# Altium schematic sheet p.SchDoc
size A3
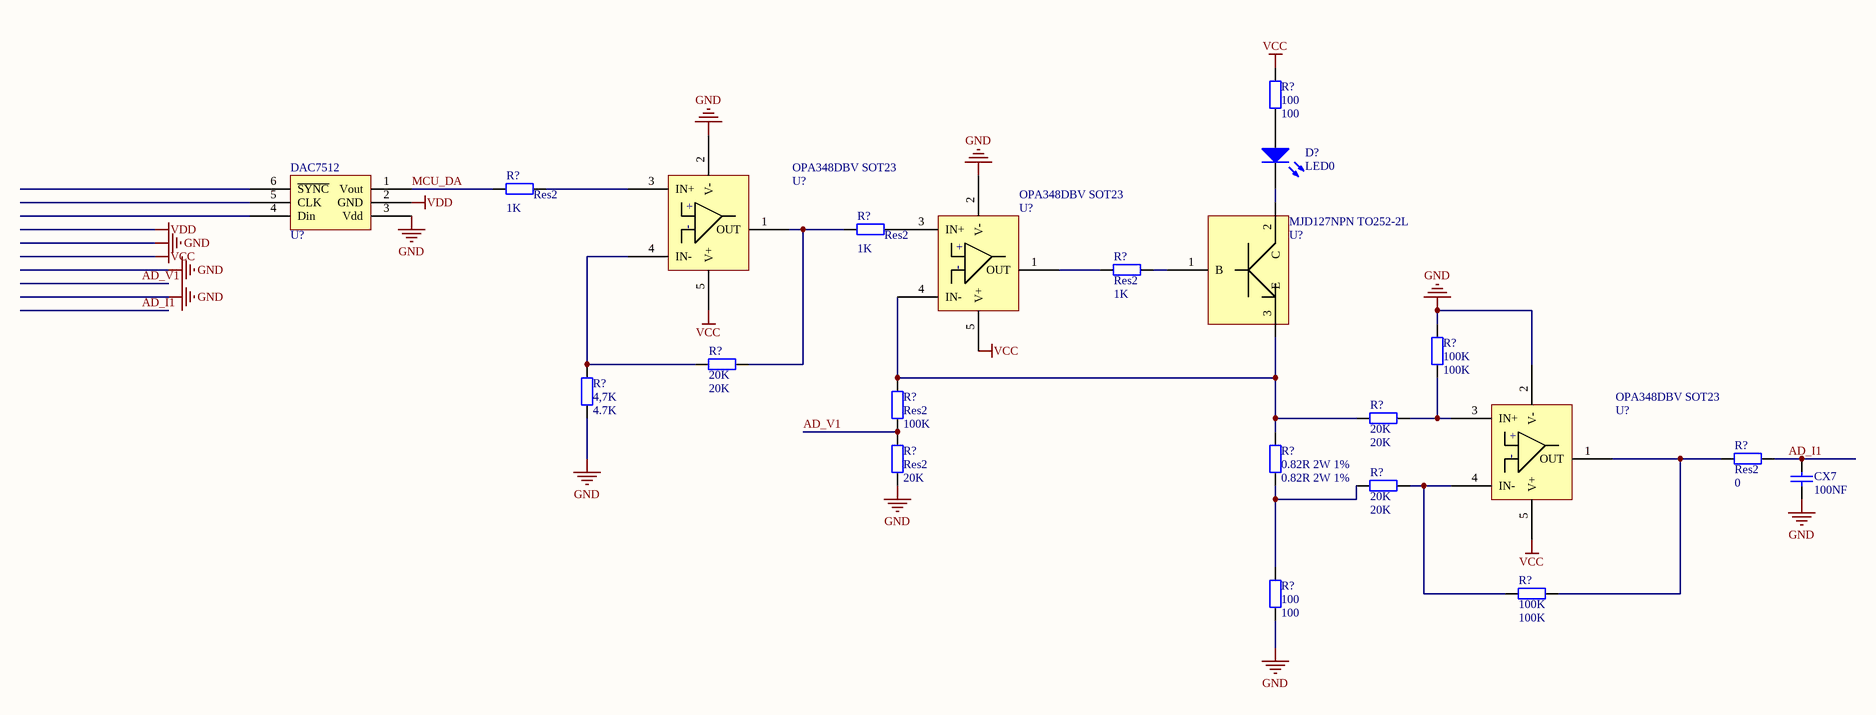
[diagram p0: p.SchDoc]

## Parts
(Parts that share a designator on the sheet are numbered #1, #2 ... from top to bottom, then left to right.)
CX7  100NF  [0603]
D?  LED0  [LED-0]
DAC7512  U?
MJD127NPN_TO252-2L  U?
OPA348DBV_SOT23#1  U?
OPA348DBV_SOT23#2  U?
OPA348DBV_SOT23#3  U?
R?#1  100  [AXIAL-0.4]
R?#2  Res2  value 1K  [AXIAL-0.4]
R?#3  Res2  value 1K  [AXIAL-0.4]
R?#4  Res2  value 1K  [AXIAL-0.4]
R?#5  100K  [AXIAL-0.4]
R?#6  4,7K  value 4.7K  [AXIAL-0.4]
R?#7  20K  [AXIAL-0.4]
R?#8  Res2  value 100K  [AXIAL-0.4]
R?#9  20K  [AXIAL-0.4]
R?#10  Res2  value 20K  [AXIAL-0.4]
R?#11  0.82R 2W 1%  [AXIAL-0.4]
R?#12  20K  [AXIAL-0.4]
R?#13  Res2  value 0  [AXIAL-0.4]
R?#14  100  [AXIAL-0.4]
R?#15  100K  [AXIAL-0.4]

## Nets
GND: CX7.1 DAC7512.3(Vdd) OPA348DBV_SOT23#1.2(V-) OPA348DBV_SOT23#2.2(V-) OPA348DBV_SOT23#3.2(V-) R?#5.2 R?#6.2 R?#10.2 R?#14.2
VCC: OPA348DBV_SOT23#1.5(V+) OPA348DBV_SOT23#2.5(V+) OPA348DBV_SOT23#3.5(V+) R?#1.2
VDD: DAC7512.2(GND)
AD_I1: CX7.2 R?#13.1
AD_V1: R?#8.2 R?#10.1
MCU_DA: DAC7512.1(Vout) R?#2.2
NetD?_1: D?.1(A) R?#1.1
NetD?_2: D?.2(K) MJD127NPN_TO252-2L.2(C)
NetMJD127NPN_TO252-2L_1: MJD127NPN_TO252-2L.1(B) R?#4.1
NetMJD127NPN_TO252-2L_3: MJD127NPN_TO252-2L.3(E) OPA348DBV_SOT23#2.4(IN-) R?#8.1 R?#9.1 R?#11.1
NetOPA348DBV_SOT23#1_1: OPA348DBV_SOT23#1.1(OUT) R?#3.2 R?#7.1
NetOPA348DBV_SOT23#1_3: OPA348DBV_SOT23#1.3(IN+) R?#2.1
NetOPA348DBV_SOT23#1_4: OPA348DBV_SOT23#1.4(IN-) R?#6.1 R?#7.2
NetOPA348DBV_SOT23#2_1: OPA348DBV_SOT23#2.1(OUT) R?#4.2
NetOPA348DBV_SOT23#2_3: OPA348DBV_SOT23#2.3(IN+) R?#3.1
NetOPA348DBV_SOT23#3_1: OPA348DBV_SOT23#3.1(OUT) R?#13.2 R?#15.1
NetOPA348DBV_SOT23#3_3: OPA348DBV_SOT23#3.3(IN+) R?#5.1 R?#9.2
NetOPA348DBV_SOT23#3_4: OPA348DBV_SOT23#3.4(IN-) R?#12.2 R?#15.2
NetR?#11_2: R?#11.2 R?#12.1 R?#14.1

Not connected (* = marked no-connect by the designer): DAC7512 4(Din) 5(CLK) 6(~{SYNC})

## Notes on the sheet
- (in symbol OPA348DBV) +     -

## Library data of the parts
CX7 = 104: Capacitor
D? = LED0: Typical INFRARED GaAs LED; Published: 8-Jun-2000; LatestRevisionDate: 08-Jul-2005; LatestRevisionNote: Mech Layer 1 removed.; PackageReference: LED-0; Publisher: Altium Limited; PackageDescription: LED; 2 Leads
DAC7512 = DAC7512
MJD127NPN_TO252-2L = MJD127: MJD127NPN
OPA348DBV_SOT23#1-OPA348DBV_SOT23#3 = OPA348DBV
R?#1-R?#15 = Res2: Resistor; Published: 8-Jun-2000; LatestRevisionDate: 17-Jul-2002; LatestRevisionNote: Re-released for DXP Platform.; PackageReference: AXIAL-0.4; Publisher: Altium Limited; PackageDescription: Axial Device, Thru-Hole; 2 Leads; 0.4 in Pin Spacing
  R?#1 R?#14: Value: 100
  R?#5 R?#15: Value: 100K
  R?#7 R?#9 R?#12: Value: 20K
  R?#11: Value: 0.82R 2W 1%